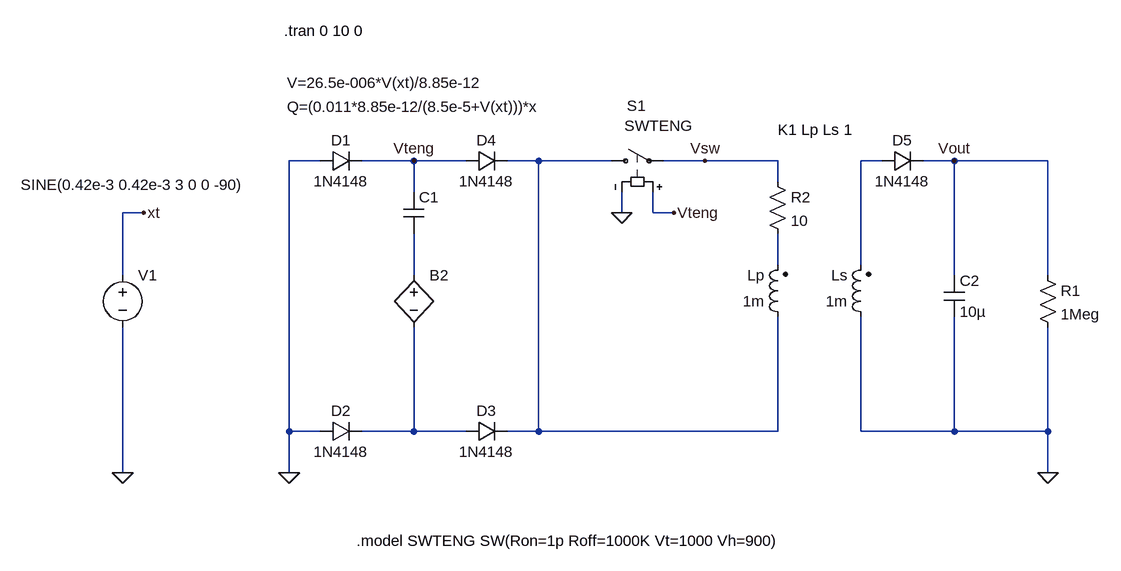
[diagram p0: schematic TENG_SW.asc]
TENG_SW.asc, the LTspice schematic file:
Version 4.1
SHEET 1 1672 720
WIRE 384 -16 336 -16
WIRE 528 -16 448 -16
WIRE 608 -16 528 -16
WIRE 720 -16 672 -16
WIRE 832 -16 720 -16
WIRE 976 -16 912 -16
WIRE 1088 -16 976 -16
WIRE 1248 -16 1216 -16
WIRE 1360 -16 1312 -16
WIRE 1504 -16 1360 -16
WIRE 1088 16 1088 -16
WIRE 528 32 528 -16
WIRE 112 64 80 64
WIRE 848 64 848 32
WIRE 896 64 896 32
WIRE 928 64 896 64
WIRE 1088 144 1088 96
WIRE 1216 144 1216 -16
WIRE 80 160 80 64
WIRE 528 160 528 96
WIRE 1360 160 1360 -16
WIRE 1504 160 1504 -16
WIRE 336 400 336 -16
WIRE 384 400 336 400
WIRE 528 400 528 240
WIRE 528 400 448 400
WIRE 608 400 528 400
WIRE 720 400 720 -16
WIRE 720 400 672 400
WIRE 1088 400 1088 224
WIRE 1088 400 720 400
WIRE 1216 400 1216 224
WIRE 1360 400 1360 224
WIRE 1360 400 1216 400
WIRE 1504 400 1504 240
WIRE 1504 400 1360 400
WIRE 80 464 80 240
WIRE 336 464 336 400
WIRE 1504 464 1504 400
FLAG 336 464 0
FLAG 80 464 0
FLAG 112 64 xt
FLAG 1504 464 0
FLAG 848 64 0
FLAG 528 -16 Vteng
FLAG 928 64 Vteng
FLAG 1360 -16 Vout
FLAG 976 -16 Vsw
SYMBOL bv 528 144 R0
WINDOW 3 -195 -280 Left 2
SYMATTR Value V=26.5e-006*V(xt)/8.85e-12
SYMATTR InstName B2
SYMBOL cap 512 32 R0
WINDOW 3 -179 -131 Left 2
SYMATTR Value Q=(0.011*8.85e-12/(8.5e-5+V(xt)))*x
SYMATTR InstName C1
SYMBOL diode 384 0 R270
WINDOW 0 32 32 VTop 2
WINDOW 3 0 32 VBottom 2
SYMATTR InstName D1
SYMATTR Value 1N4148
SYMBOL diode 384 416 R270
WINDOW 0 32 32 VTop 2
WINDOW 3 0 32 VBottom 2
SYMATTR InstName D2
SYMATTR Value 1N4148
SYMBOL diode 608 416 R270
WINDOW 0 32 32 VTop 2
WINDOW 3 0 32 VBottom 2
SYMATTR InstName D3
SYMATTR Value 1N4148
SYMBOL diode 608 0 R270
WINDOW 0 32 32 VTop 2
WINDOW 3 0 32 VBottom 2
SYMATTR InstName D4
SYMATTR Value 1N4148
SYMBOL voltage 80 144 R0
WINDOW 3 -157 -123 Left 2
SYMATTR Value SINE(0.42e-3 0.42e-3 3 0 0 -90)
SYMATTR InstName V1
SYMBOL cap 1344 160 R0
SYMATTR InstName C2
SYMATTR Value 10µ
SYMBOL res 1488 144 R0
SYMATTR InstName R1
SYMATTR Value 1Meg
SYMBOL sw 816 -16 R270
WINDOW 0 85 40 VRight 2
WINDOW 3 54 36 VRight 2
SYMATTR InstName S1
SYMATTR Value SWTENG
SYMBOL res 1072 0 R0
SYMATTR InstName R2
SYMATTR Value 10
SYMBOL ind2 1104 240 R180
WINDOW 0 36 80 Left 2
WINDOW 3 36 40 Left 2
SYMATTR InstName Lp
SYMATTR Value 1m
SYMATTR SpiceLine Rser=1m
SYMBOL diode 1248 0 R270
WINDOW 0 32 32 VTop 2
WINDOW 3 0 32 VBottom 2
SYMATTR InstName D5
SYMATTR Value 1N4148
SYMBOL ind2 1232 240 R180
WINDOW 0 36 80 Left 2
WINDOW 3 36 40 Left 2
SYMATTR InstName Ls
SYMATTR Value 1m
SYMATTR SpiceLine Rser=1m
TEXT 328 -216 Left 2 !.tran 0 10 0
TEXT 440 568 Left 2 !.model SWTENG SW(Ron=1p Roff=1000K Vt=1000 Vh=900)
TEXT 1088 -64 Left 2 !K1 Lp Ls 1

The netlist it stands for:
* TENG_SW.asc
B2 N004 N005 V=26.5e-006*V(xt)/8.85e-12
C1 Vteng N004 Q=(0.011*8.85e-12/(8.5e-5+V(xt)))*x
D1 0 Vteng 1N4148
D2 0 N005 1N4148
D3 N005 N001 1N4148
D4 Vteng N001 1N4148
V1 xt 0 SINE(0.42e-3 0.42e-3 3 0 0 -90)
C2 Vout 0 10µ
R1 Vout 0 1Meg
S1 N001 Vsw Vteng 0 SWTENG
R2 Vsw N003 10
Lp N001 N003 1m Rser=1m
D5 N002 Vout 1N4148
Ls 0 N002 1m Rser=1m
.model D D
.lib standard.dio
.tran 0 10 0
.model SWTENG SW(Ron=1p Roff=1000K Vt=1000 Vh=900)
K1 Lp Ls 1
.backanno
.end